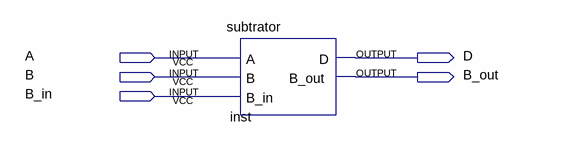
[diagram p0: schematic sheet]
// Quartus schematic aula07.bdf as structural Verilog: 1 symbols, 5 pins
module aula07 (
  input  A,
  input  B,
  input  B_in,
  output D,
  output B_out
);

  subtrator inst (.A(A), .B(B), .B_in(B_in), .D(D), .B_out(B_out));
endmodule
